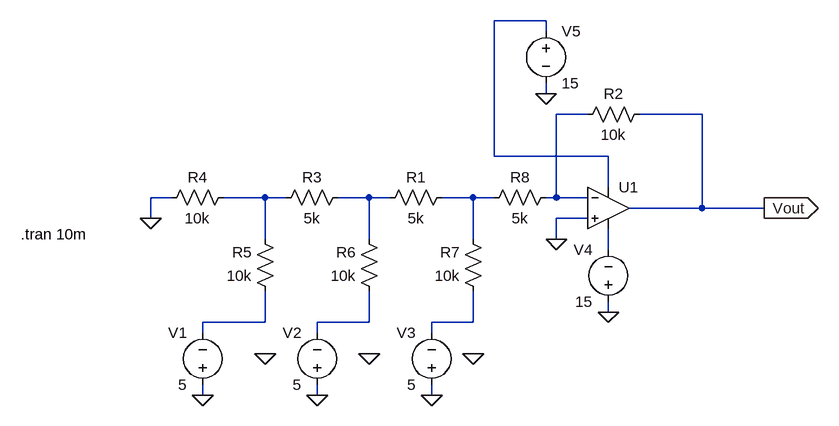
[diagram p0: schematic R-2R_Ladder_DAC.asc]
R-2R_Ladder_DAC.asc, the LTspice schematic file:
Version 4
SHEET 1 880 680
WIRE 208 -208 128 -208
WIRE 208 -192 208 -208
WIRE 208 -96 208 -112
WIRE 272 -64 224 -64
WIRE 448 -64 352 -64
WIRE 128 0 128 -208
WIRE 304 0 128 0
WIRE 304 48 304 0
WIRE -368 64 -400 64
WIRE -224 64 -288 64
WIRE -192 64 -224 64
WIRE -64 64 -112 64
WIRE -32 64 -64 64
WIRE 96 64 48 64
WIRE 128 64 96 64
WIRE 224 64 224 -64
WIRE 224 64 208 64
WIRE 272 64 224 64
WIRE 448 80 448 -64
WIRE 448 80 336 80
WIRE 544 80 448 80
WIRE -400 96 -400 64
WIRE 272 96 224 96
WIRE -224 128 -224 64
WIRE -64 128 -64 64
WIRE 96 128 96 64
WIRE 224 128 224 96
WIRE 304 144 304 112
WIRE 304 240 304 224
WIRE -224 256 -224 208
WIRE -224 256 -320 256
WIRE -64 256 -64 208
WIRE -64 256 -144 256
WIRE 96 256 96 208
WIRE 96 256 32 256
WIRE -320 272 -320 256
WIRE -144 272 -144 256
WIRE 32 272 32 256
WIRE -320 368 -320 352
WIRE -144 368 -144 352
WIRE 32 368 32 352
FLAG 96 304 0
FLAG -400 96 0
FLAG 208 -96 0
FLAG 304 240 0
FLAG 32 368 0
FLAG -144 368 0
FLAG -320 368 0
FLAG 224 128 0
FLAG 544 80 Vout
IOPIN 544 80 Out
FLAG -64 304 0
FLAG -224 304 0
SYMBOL OpAmps\\UniversalOpamp2 304 80 R0
SYMATTR InstName U1
SYMBOL res 64 48 R90
WINDOW 0 0 56 VBottom 2
WINDOW 3 32 56 VTop 2
SYMATTR InstName R1
SYMATTR Value 5k
SYMBOL res 368 -80 R90
WINDOW 0 0 56 VBottom 2
WINDOW 3 32 56 VTop 2
SYMATTR InstName R2
SYMATTR Value 10k
SYMBOL res -96 48 R90
WINDOW 0 0 56 VBottom 2
WINDOW 3 32 56 VTop 2
SYMATTR InstName R3
SYMATTR Value 5k
SYMBOL res -272 48 R90
WINDOW 0 0 56 VBottom 2
WINDOW 3 32 56 VTop 2
SYMATTR InstName R4
SYMATTR Value 10k
SYMBOL res -208 224 R180
WINDOW 0 36 76 Left 2
WINDOW 3 36 40 Left 2
SYMATTR InstName R5
SYMATTR Value 10k
SYMBOL res -48 224 R180
WINDOW 0 36 76 Left 2
WINDOW 3 36 40 Left 2
SYMATTR InstName R6
SYMATTR Value 10k
SYMBOL res 112 224 R180
WINDOW 0 36 76 Left 2
WINDOW 3 36 40 Left 2
SYMATTR InstName R7
SYMATTR Value 10k
SYMBOL voltage -320 368 R180
WINDOW 0 24 96 Left 2
WINDOW 3 24 16 Left 2
WINDOW 123 0 0 Left 0
WINDOW 39 0 0 Left 0
SYMATTR InstName V1
SYMATTR Value 5
SYMBOL voltage -144 368 R180
WINDOW 0 24 96 Left 2
WINDOW 3 24 16 Left 2
WINDOW 123 0 0 Left 0
WINDOW 39 0 0 Left 0
SYMATTR InstName V2
SYMATTR Value 5
SYMBOL voltage 32 368 R180
WINDOW 0 24 96 Left 2
WINDOW 3 24 16 Left 2
WINDOW 123 0 0 Left 0
WINDOW 39 0 0 Left 0
SYMATTR InstName V3
SYMATTR Value 5
SYMBOL voltage 304 240 R180
WINDOW 0 24 96 Left 2
WINDOW 3 24 16 Left 2
WINDOW 123 0 0 Left 0
WINDOW 39 0 0 Left 0
SYMATTR InstName V4
SYMATTR Value 15
SYMBOL voltage 208 -208 R0
WINDOW 123 0 0 Left 0
WINDOW 39 0 0 Left 0
SYMATTR InstName V5
SYMATTR Value 15
SYMBOL res 224 48 R90
WINDOW 0 0 56 VBottom 2
WINDOW 3 32 56 VTop 2
SYMATTR InstName R8
SYMATTR Value 5k
TEXT -600 120 Left 2 !.tran 10m

The netlist it stands for:
* R-2R_Ladder_DAC.asc
XU1 0 N002 N001 N006 Vout level.2 Avol=1Meg GBW=10Meg Slew=10Meg ilimit=25m rail=0 Vos=0 phimargin=45 en=0 enk=0 in=0 ink=0 Rin=500Meg  ; pins IN+ IN- V+ V- OUT
R1 N005 N004 5k
R2 Vout N002 10k
R3 N004 N003 5k
R4 N003 0 10k
R5 N007 N003 10k
R6 N008 N004 10k
R7 N009 N005 10k
V1 0 N007 5
V2 0 N008 5
V3 0 N009 5
V4 0 N006 15
V5 N001 0 15
R8 N002 N005 5k
.tran 10m
.lib UniversalOpamps2.sub
.backanno
.end